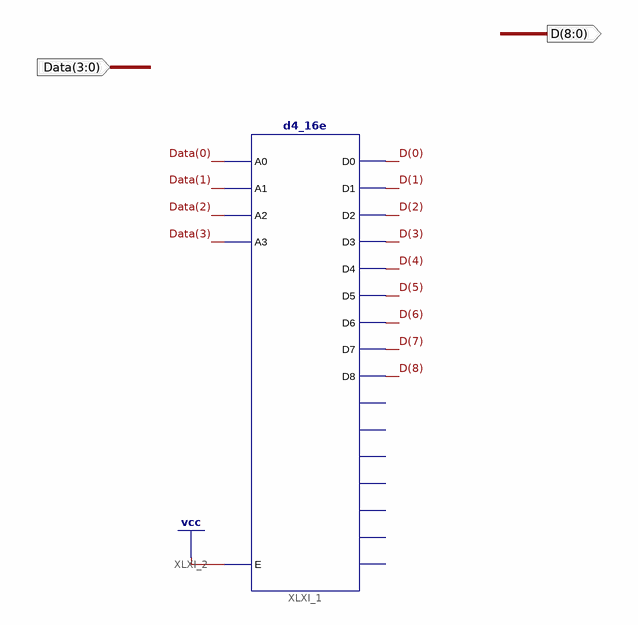
[diagram p0: schematic sheet 1]
// Xilinx ISE schematic Data4_8.sch (spartan6) as structural Verilog: 1 symbols, 2 ports
module Data4_8 (
  input  [3:0] Data,
  output [8:0] D
);

  d4_16e XLXI_1 (
    .A0(Data[0]), .A1(Data[1]), .A2(Data[2]), .A3(Data[3]), .E(1'b1), .D0(D[0]), .D1(D[1]), .D2(D[2]),
    .D3(D[3]), .D4(D[4]), .D5(D[5]), .D6(D[6]), .D7(D[7]), .D8(D[8]));  // open: D10, D11, D12, D13, D14, D15, D9
endmodule
